# EAGLE design untitled (EAGLE 5.10)
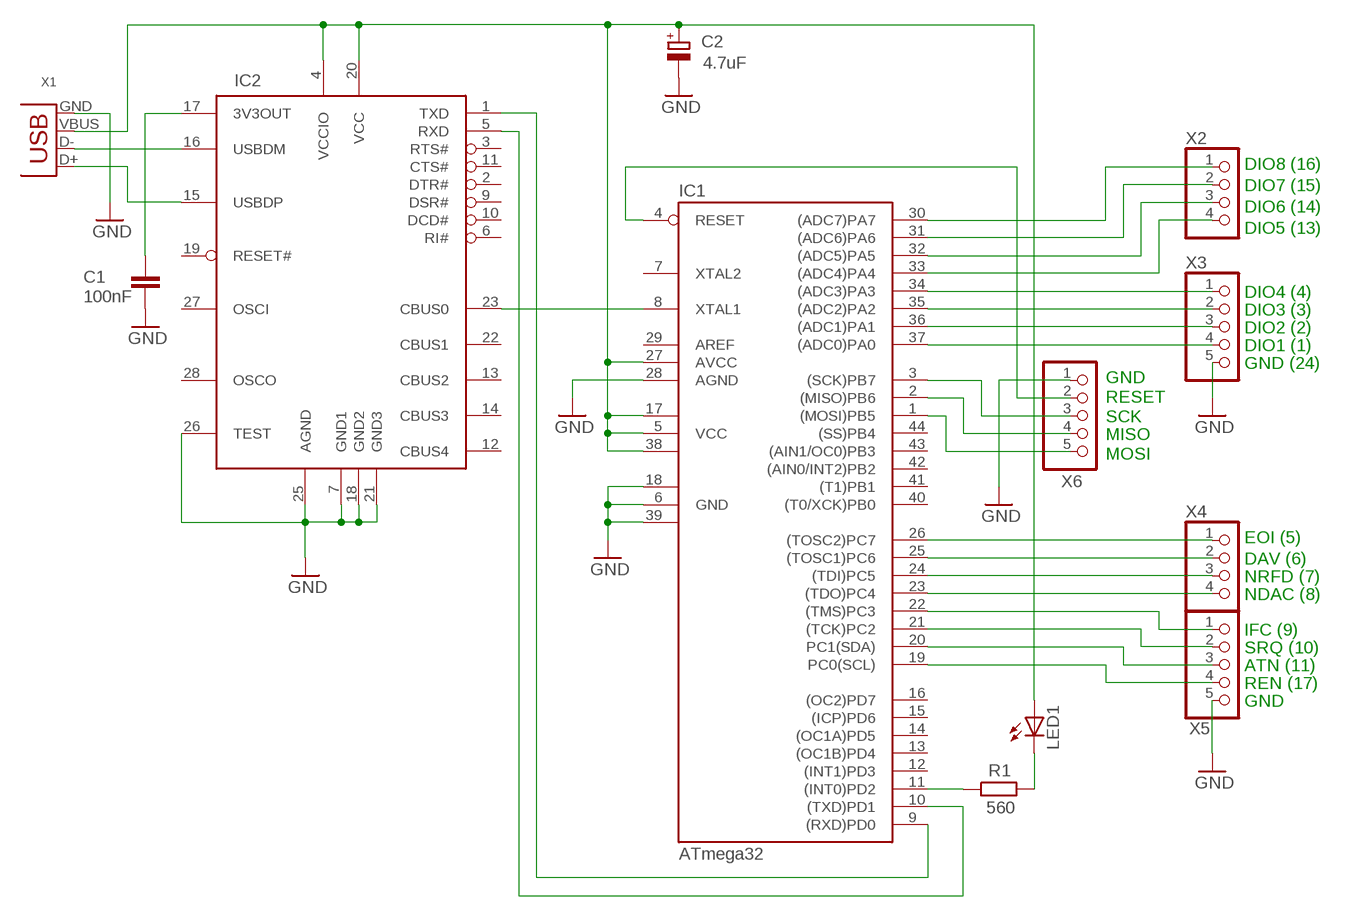
[diagram p0: schematic, sheet 1]

## Parts
C1  100nF  C-EUC0805  [C0805]
C2  4.7uF  CPOL-EUSMCB  [SMC_B]
IC1  ATmega32  MEGA32-A  [TQFP44]
IC2  FT232RL  [SSOP28DB]
LED1  LEDCHIP-LED0805  [CHIP-LED0805]
R1  560  R-EU_R0805  [R0805]
X1  USB-MB-S  [USB-MB-S]
X2  PINHD-1X4  [1X04]
X3  PINHD-1X5  [1X05]
X4  PINHD-1X4  [1X04]
X5  PINHD-1X5  [1X05]
X6  PINHD-1X5  [1X05]

## Nets
GND: C1.2 C2.- IC1.6(GND) IC1.18(GND1) IC1.28(AGND) IC1.39(GND2) IC2.7(GND1) IC2.18(GND2) IC2.21(GND3) IC2.25(AGND) IC2.26(TEST) X1.GND X3.5 X5.5 X6.1
N$1: IC2.15(USBDP) X1.D+
N$2: IC2.16(USBDM) X1.D-
N$3: C2.+ IC1.5(VCC) IC1.17(VCC1) IC1.27(AVCC) IC1.38(VCC2) IC2.4(VCCIO) IC2.20(VCC) LED1.A X1.VBUS
N$4: C1.1 IC2.17(3V3OUT)
N$5: IC1.8(XTAL1) IC2.23(CBUS0)
N$6: IC1.10((TXD)PD1) IC2.5(RXD)
N$7: IC1.9((RXD)PD0) IC2.1(TXD)
N$8: IC1.30((ADC7)PA7) X2.1
N$9: IC1.31((ADC6)PA6) X2.2
N$10: IC1.32((ADC5)PA5) X2.3
N$11: IC1.33((ADC4)PA4) X2.4
N$12: IC1.34((ADC3)PA3) X3.1
N$13: IC1.35((ADC2)PA2) X3.2
N$14: IC1.36((ADC1)PA1) X3.3
N$15: IC1.37((ADC0)PA0) X3.4
N$16: IC1.26((TOSC2)PC7) X4.1
N$17: IC1.25((TOSC1)PC6) X4.2
N$18: IC1.24((TDI)PC5) X4.3
N$19: IC1.23((TDO)PC4) X4.4
N$20: IC1.22((TMS)PC3) X5.1
N$21: IC1.21((TCK)PC2) X5.2
N$22: IC1.20(PC1(SDA)) X5.3
N$23: IC1.19(PC0(SCL)) X5.4
N$24: IC1.1((MOSI)PB5) X6.5
N$25: IC1.2((MISO)PB6) X6.4
N$26: IC1.3((SCK)PB7) X6.3
N$27: IC1.4(RESET) X6.2
N$29: IC1.11((INT0)PD2) R1.1
N$30: LED1.C R1.2
Unconnected: IC1.7(XTAL2) IC1.12((INT1)PD3) IC1.13((OC1B)PD4) IC1.14((OC1A)PD5) IC1.15((ICP)PD6) IC1.16((OC2)PD7) IC1.40((T0/XCK)PB0) IC1.41((T1)PB1) IC1.42((AIN0/INT2)PB2) IC1.43((AIN1/OC0)PB3) IC1.44((SS)PB4) IC2.2(DTR#) IC2.3(RTS#) IC2.6(RI#) IC2.9(DSR#) IC2.10(DCD#) IC2.11(CTS#) IC2.12(CBUS4) IC2.13(CBUS2) IC2.14(CBUS3) IC2.19(RESET#) IC2.22(CBUS1) IC2.27(OSCI) IC2.28(OSCO)

## Notes on the sheet
- DIO8 (16)
- DIO7 (15)
- DIO6 (14)
- DIO5 (13)
- DIO4 (4)
- DIO3 (3)
- DIO2 (2)
- DIO1 (1)
- GND (24)
- GND
- RESET
- SCK
- MISO
- MOSI
- EOI (5)
- DAV (6)
- NRFD (7)
- NDAC (8)
- IFC (9)
- SRQ (10)
- ATN (11)
- REN (17)
- GND

## Power pins joined to a net without a drawn wire
AREF: IC1.29(AREF)

## Library data of the parts
C1 = rcl:C-EU: CAPACITOR, European symbol
C2 = rcl:CPOL-EU: POLARIZED CAPACITOR, European symbol
IC1 = avr-4:MEGA32: MICROCONTROLLER 32 Kbytes FLASH 2 Kbytes SRAM 1 Kbytes EEPROM USART 8-channel 10 bit ADC
IC2 = ftdichip-3:FT232RL: USB UART 4th Generation USB UART (USB <-> Serial) Controller
LED1 = led:LED: LED OSRAM: - CHIPLED LG R971, LG N971, LY N971, LG Q971, LY Q971, LO R971, LY R971 LH N974, LH R974 LS Q976, LO Q976, LY Q976 LO Q996 - Hyper CHIPLED LW Q18S LB Q993, LB Q99A, LB R99A - SideLED LS A670, LO A670, LY A670, LG A670, LP A670 LB A673, LV A673, LT A673, LW A673 LH A674 LY A675 LS A676, LA A676, LO A676, LY A676, LW A676 LS A679, LY A679, LG A679 - Hyper Micro SIDELED® LS Y876, LA Y876, LO Y876, LY Y876 LT Y87S - SmartLED LW L88C, LW L88S LB L89C, LB L89S, LG L890 LS L89K, LO L89K, LY L89K LS L896, LA L896, LO L896, LY L896 - TOPLED LS T670, LO T670, LY T670, LG T670, LP T670 LSG T670, LSP T670, LSY T670, LOP T670, LYG T670 LG T671, LOG T671, LSG T671 LB T673, LV T673, LT T673, LW T673 LH T674 LS T676, LA T676, LO T676, LY T676, LB T676, LH T676, LSB T676, LW T676 LB T67C, LV T67C, LT T67C, LS T67K, LO T67K, LY T67K, LW E67C LS E67B, LA E67B, LO E67B, LY E67B, LB E67C, LV E67C, LT E67C LW T67C LS T679, LY T679, LG T679 LS T770, LO T770, LY T770, LG T770, LP T770 LB T773, LV T773, LT T773, LW T773 LH T774 LS E675, LA E675, LY E675, LS T675 LS T776, LA T776, LO T776, LY T776, LB T776 LHGB T686 LT T68C, LB T68C - Hyper Mini TOPLED® LB M676 - Mini TOPLED Santana® LG M470 LS M47K, LO M47K, LY M47K Source: http://www.osram.convergy.de - LUMILED® LXK2-PW12-R00, LXK2-PW12-S00, LXK2-PW14-U00, LXK2-PW14-V00 LXK2-PM12-R00, LXK2-PM12-S00, LXK2-PM14-U00 LXK2-PE12-Q00, LXK2-PE12-R00, LXK2-PE12-S00, LXK2-PE14-T00, LXK2-PE14-U00 LXK2-PB12-K00, LXK2-PB12-L00, LXK2-PB12-M00, LXK2-PB14-N00, LXK2-PB14-P00, LXK2-PB14-Q00 LXK2-PR12-L00, LXK2-PR12-M00, LXK2-PR14-Q00, LXK2-PR14-R00 LXK2-PD12-Q00, LXK2-PD12-R00, LXK2-PD12-S00 LXK2-PH12-R00, LXK2-PH12-S00 LXK2-PL12-P00, LXK2-PL12-Q00, LXK2-PL12-R00 Source: www.luxeon.com
R1 = rcl:R-EU_: RESISTOR, European symbol
X1 = con-usb-3:USB: USB Connectors
X2 X4 = pinhead:PINHD-1X4: PIN HEADER
X3 X5 X6 = pinhead:PINHD-1X5: PIN HEADER

## Board
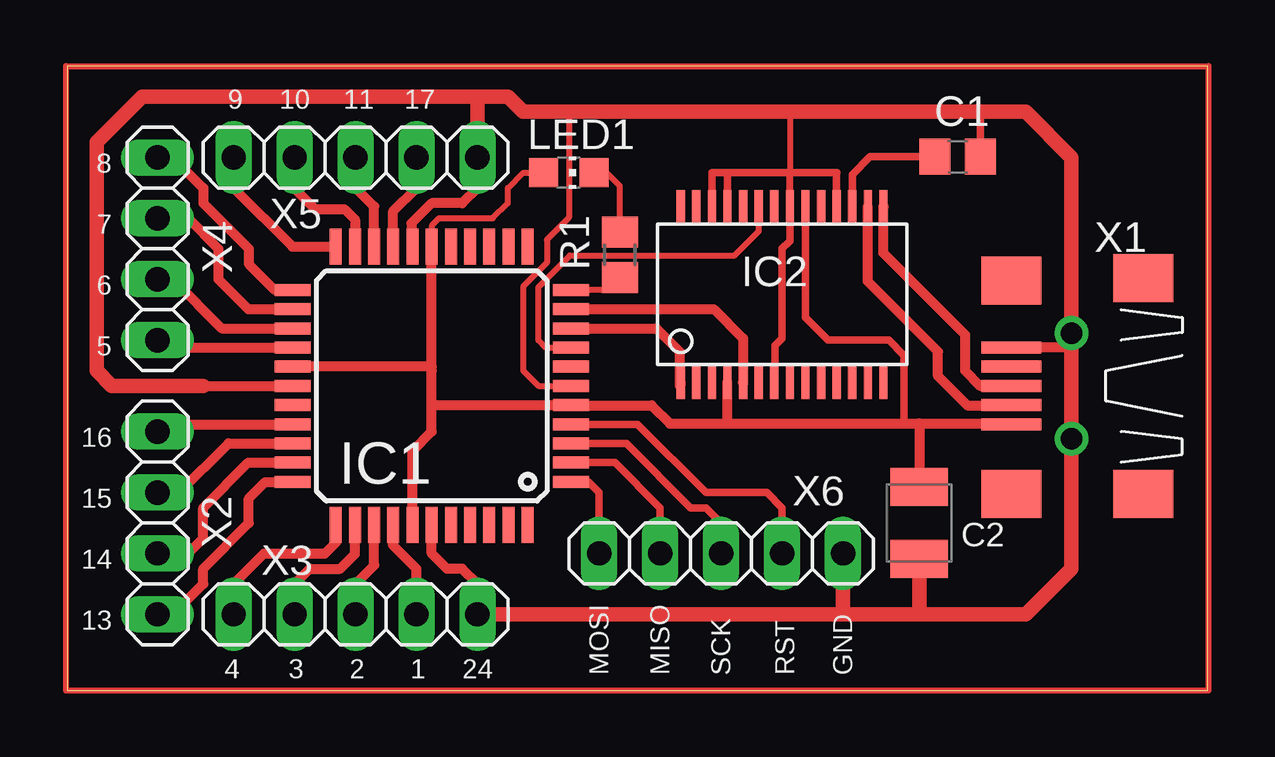
[diagram p1: board, top side]
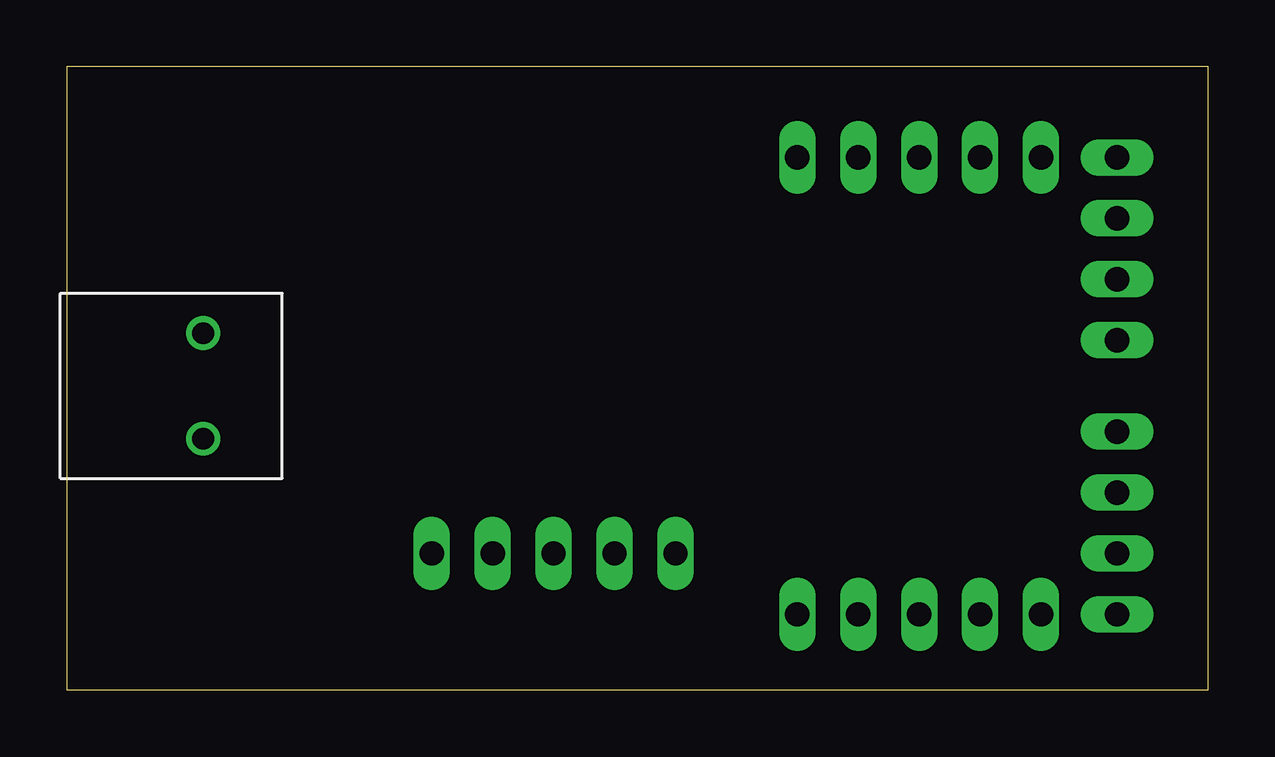
[diagram p2: board, bottom side, seen from below]

Size 47.55 x 26.03 mm. Coordinates in mm from the lower left corner, seen from the top.
Outline: 0,0 47.55,0 47.55,26.03 0,26.03 0,0
Copper layers (1*16): Top 0.035mm / dielectric 1.5mm / Bottom 0.035mm
Design rules "default": minimum track width 10mil, minimum drill 24mil, track to track 8mil, track to pad 8mil, pad to pad 8mil, via to via 8mil, smd to smd 8mil, copper to edge 40mil, drill to drill 8mil, minimum pad ring 10mil, minimum via ring 8mil, stop-mask expansion 4mil, vias tented up to drill 0mil, thermal gap 10mil

### Footprints (pad centres in the part's own frame; a part is rotated, then mirrored left to right if it is on the bottom)
C0805 = smd 1.3 x 1.5: 1 -0.95,0; 2 0.95,0
SMC_B = smd 1.6 x 2.4: + -1.5,0; - 1.5,0
TQFP44 = smd 1.5 x 0.5: 1 -5.8,4; 2 -5.8,3.2; 3 -5.8,2.4; 4 -5.8,1.6; 5 -5.8,0.8; 6 -5.8,0; 7 -5.8,-0.8; 8 -5.8,-1.6; 9 -5.8,-2.4; 10 -5.8,-3.2; 11 -5.8,-4; 23 5.8,-4; 24 5.8,-3.2; 25 5.8,-2.4; 26 5.8,-1.6; 27 5.8,-0.8; 28 5.8,0; 29 5.8,0.8; 30 5.8,1.6; 31 5.8,2.4; 32 5.8,3.2; 33 5.8,4 | smd 0.5 x 1.5: 12 -4,-5.8; 13 -3.2,-5.8; 14 -2.4,-5.8; 15 -1.6,-5.8; 16 -0.8,-5.8; 17 0,-5.8; 18 0.8,-5.8; 19 1.6,-5.8; 20 2.4,-5.8; 21 3.2,-5.8; 22 4,-5.8; 34 4,5.8; 35 3.2,5.8; 36 2.4,5.8; 37 1.6,5.8; 38 0.8,5.8; 39 0,5.8; 40 -0.8,5.8; 41 -1.6,5.8; 42 -2.4,5.8; 43 -3.2,5.8; 44 -4,5.8
SSOP28DB = smd 0.348 x 1.397: 1 -4.225,-3.656; 2 -3.575,-3.656; 3 -2.925,-3.656; 4 -2.275,-3.656; 5 -1.625,-3.656; 6 -0.975,-3.656; 7 -0.325,-3.656; 8 0.325,-3.656; 9 0.975,-3.656; 10 1.625,-3.656; 11 2.275,-3.656; 12 2.925,-3.656; 13 3.575,-3.656; 14 4.225,-3.656; 15 4.225,3.656; 16 3.575,3.656; 17 2.925,3.656; 18 2.275,3.656; 19 1.625,3.656; 20 0.975,3.656; 21 0.325,3.656; 22 -0.325,3.656; 23 -0.975,3.656; 24 -1.625,3.656; 25 -2.275,3.656; 26 -2.925,3.656; 27 -3.575,3.656; 28 -4.225,3.656
CHIP-LED0805 = smd 1.2 x 1.2: A 0,-1.05; C 0,1.05
R0805 = smd 1.3 x 1.5: 1 -0.95,0; 2 0.95,0
USB-MB-S = smd 2.5 x 0.5: D+ 2.5,0; D- 2.5,0.8; GND 2.5,-1.6; ID 2.5,-0.8; VBUS 2.5,1.6 | smd 2.5 x 2: P$1 -3,-4.5; P$2 -3,4.5; P$3 2.5,-4.4; P$4 2.5,4.5 | drill 0.9 round: P$5 0,2.2; P$6 0,-2.2
1X04 = drill 1.016 long: 1 -3.81,0; 2 -1.27,0; 3 1.27,0; 4 3.81,0
1X05 = drill 1.016 long: 1 -5.08,0; 2 -2.54,0; 3 0,0; 4 2.54,0; 5 5.08,0

### Placement (x,y rotation side)
C1  37.12,22.25 0 top
C2  35.52,6.98 270 top
IC1  15.2,12.7 180 top
IC2  29.81,16.51 0 top
LED1  20.92,21.59 270 top
R1  23.05,18.16 90 top
X1  41.87,12.7 180 top
X2  3.77,6.98 270 top
X3  12.03,3.17 0 top
X4  3.77,18.41 90 top
X5  12.03,22.22 0 top
X6  27.27,5.71 180 top

### Tracks (layer width: path | path; a pad name or v marks a point on that pad's centre or on a via)
GND
  Top 0.254: IC1.6 19.65,12.7 19.01,13.33 19.01,16.84 20,17.83 20,18.79 20.92,19.71 20.92,24.12 20.92,24.23 | 30.16,24.12 30.16,24.18 30.13,24.15 IC2.21 30.13,20.4 30.11,20.42 30.11,21.59 | 32.35,24.12 32.36,24.14
  Top 0.305: 32.08,21.59 IC2.18 | 32.08,21.59 32.09,21.59 | IC2.26 26.88,21.59 27.53,21.59 | 27.53,21.59 30.11,21.59 32.08,21.59 | 27.53,21.59 IC2.25 | IC2.21 30.13,18.73 29.81,18.41 29.81,14.68 29.5,14.37 29.5,12.85 29.48,12.83 | 29.48,12.83 29.45,12.8 | 29.48,12.83 IC2.7 | 39.36,14.27 39.37,14.27 X1.GND | C2.- 35.52,5.71 | 38.09,24.12 38.09,24.18 38.07,24.16 C1.2
  Top 0.406: IC1.18 14.36,18.5 14.36,19.48 15.2,20.32 16.47,20.32 17.11,20.95 17.11,22.86 | 15.2,6.98 IC1.39 15.2,5.71 15.84,5.08 16.47,5.08 17.11,4.44 X3.5 | 41.82,14.3 X1.GND | 9.49,12.7 IC1.28 5.68,12.7
  Top 0.61: 32.35,3.17 X3.5 | 35.52,3.17 32.35,3.17 | 32.35,3.17 X6.1 | 35.52,3.17 C2.- | 35.52,3.17 39.97,3.17 41.87,5.08 41.87,14.27 | 41.87,14.27 41.87,22.22 39.97,24.12 38.09,24.12 32.35,24.12 30.16,24.12 20.92,24.12 19.01,24.12 18.38,24.76 17.11,24.76 | 41.87,14.27 41.85,14.27 41.82,14.3 | X5.5 17.11,22.86 17.11,24.76 | 17.11,24.76 3.14,24.76 1.23,22.86 1.23,13.33 1.87,12.7 5.68,12.7
N$1
  Top 0.406: X1.D+ 38.06,12.7 37.43,13.33 37.43,14.83 34.02,18.23 IC2.15
N$2
  Top 0.406: IC2.16 33.38,17.05 36.31,14.12 36.31,13.1 37.53,11.88 39.71,11.88 39.7,11.9 X1.D-
N$3
  Top 0.254: LED1.A 19.01,21.59 18.38,20.95 18.38,20.32 17.74,19.68 15.51,19.68 15.23,19.4 15.23,18.49 15.22,18.5 IC1.17
  Top 0.305: 39.41,11.12 39.4,11.12 X1.VBUS | IC2.4 | IC2.20 30.77,20.15 30.77,15.54 31.71,14.6 34.25,14.6 34.89,13.97 34.89,11.12 | 35.5,11.12 35.5,11.17 35.52,11.15
  Top 0.406: 15.2,12.06 15.2,13.33 | 15.2,12.06 15.2,11.9 IC1.5 21,11.88 24.37,11.88 25.13,11.12 27.52,11.12 | 15.2,13.33 IC1.17 | IC1.27 15.2,13.5 15.2,13.33 | IC1.38 14.4,9.99 15.2,10.79 15.2,12.06 | 27.52,11.12 34.89,11.12 35.5,11.12 39.4,11.12 | 27.52,11.12 IC2.4 | 35.52,11.15 C2.+
N$4
  Top 0.305: IC2.17 32.73,21.51 33.46,22.25 C1.1
N$5
  Top 0.254: IC1.8 19.95,14.3 19.65,14.6 19.65,16.81 20.97,18.13 27.83,18.13 28.84,19.15 28.84,20.16 IC2.23 28.83,20.36 28.84,20.37
N$6
  Top 0.406: IC1.10 26.96,15.9 28.18,14.68 28.18,12.8 IC2.5
N$7
  Top 0.406: IC1.9 24.56,15.09 25.54,14.12 25.54,12.7 25.58,12.74 IC2.1
N$8
  Top 0.406: 3.7,10.71 X2.1 4.08,11.09 IC1.30
N$9
  Top 0.406: IC1.31 6.73,10.3 4.66,8.23 3.85,8.23 3.8,8.28 X2.2
N$10
  Top 0.406: IC1.32 7.56,9.5 5.68,7.62 5.68,6.34 5.04,5.71 X2.3
N$11
  Top 0.406: X2.4 4.41,3.17 5.68,4.44 5.68,5.08 7.58,6.98 7.58,8 8.27,8.68 9.64,8.68 9.63,8.7 IC1.33
N$12
  Top 0.406: IC1.34 11.2,6.16 10.76,5.71 8.22,5.71 6.95,4.44 X3.1
N$13
  Top 0.406: IC1.35 12,5.69 11.39,5.08 10.12,5.08 9.49,4.44 X3.2
N$14
  Top 0.406: IC1.36 12.8,5.22 12.03,4.44 X3.3
N$15
  Top 0.406: IC1.37 13.6,6.04 14.57,5.08 X3.4
N$16
  Top 0.406: 3.75,14.62 X4.1 4.08,14.3 IC1.26
N$17
  Top 0.406: IC1.25 6.45,15.09 4.41,17.14 X4.2
N$18
  Top 0.406: IC1.24 7.56,15.9 6.31,17.14 6.31,18.41 5.04,19.68 X4.3
N$19
  Top 0.406: IC1.23 8.66,16.7 7.58,17.78 7.58,18.41 5.68,20.32 5.68,20.95 4.41,22.22 X4.4
N$20
  Top 0.406: IC1.22 9.4,18.5 6.95,20.95 X5.1
N$21
  Top 0.406: IC1.21 12,19.63 11.57,20.06 10.35,20.06 9.49,20.93 X5.2 9.49,22.25
N$22
  Top 0.406: IC1.20 12.8,20.18 12.03,20.95 X5.3
N$23
  Top 0.406: IC1.19 13.6,19.98 14.57,20.95 X5.4
N$24
  Top 0.305: IC1.1 21.74,8.7 22.19,8.25 X6.5
N$25
  Top 0.305: IC1.2 22.85,9.5 24.73,7.62 X6.4
N$26
  Top 0.305: IC1.3 23.32,10.3 26,7.62 26.63,7.62 27.27,6.98 X6.3
N$27
  Top 0.305: IC1.4 23.79,11.09 26.63,8.25 29.17,8.25 29.81,7.62 X6.2
N$28
  Top 0.254: -0.04,26.03 47.59,26.03 47.59,0 -0.04,0 -0.04,26.03
N$29
  Top 0.254: R1.1 23.01,17.21 23,17.22 22.48,16.7 IC1.11
N$30
  Top 0.254: LED1.C 22.49,21.59 23.05,21.03 R1.2 | R1.2 | R1.2 23.1,19.05

### Text on the board
tPlace: 9 | 10 | 11 | 17 | 8 | 7 | 6 | 5 | 16 | 15 | 14 | 13 | 4 | 3 | 2 | 1 | 24 | MOSI | MISO | SCK | RST | GND